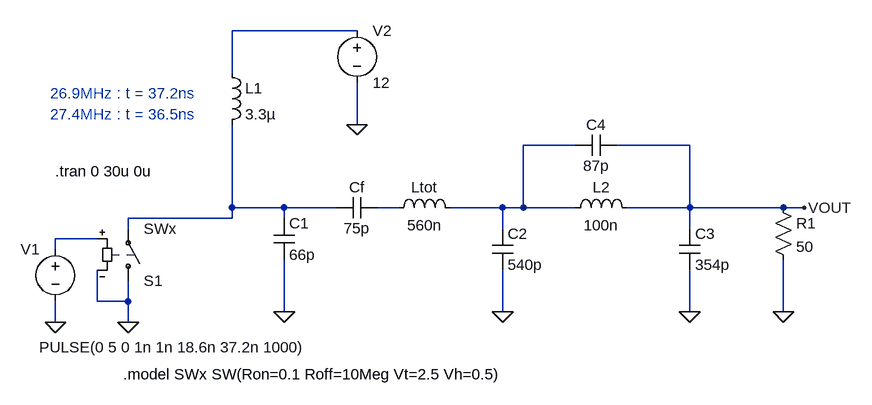
[diagram p0: schematic KD9PDP_PiMatchNotch.asc]
KD9PDP_PiMatchNotch.asc, the LTspice schematic file:
Version 4
SHEET 1 1900 680
WIRE 464 -144 272 -144
WIRE 272 -80 272 -144
WIRE 464 0 464 -64
WIRE 800 32 720 32
WIRE 976 32 864 32
WIRE 272 128 272 0
WIRE 352 128 272 128
WIRE 432 128 352 128
WIRE 528 128 496 128
WIRE 688 128 608 128
WIRE 720 128 720 32
WIRE 720 128 688 128
WIRE 800 128 720 128
WIRE 976 128 976 32
WIRE 976 128 880 128
WIRE 1120 128 976 128
WIRE 1152 128 1120 128
WIRE 272 144 272 128
WIRE 272 144 112 144
WIRE 352 144 352 128
WIRE 112 160 112 144
WIRE 688 160 688 128
WIRE 976 160 976 128
WIRE 64 176 0 176
WIRE 0 192 0 176
WIRE 64 272 64 224
WIRE 112 272 112 240
WIRE 112 272 64 272
WIRE 352 288 352 208
WIRE 688 288 688 224
WIRE 976 288 976 224
WIRE 1120 288 1120 208
WIRE 0 304 0 272
WIRE 112 304 112 272
FLAG 0 304 0
FLAG 464 0 0
FLAG 112 304 0
FLAG 352 288 0
FLAG 688 288 0
FLAG 976 288 0
FLAG 1152 128 VOUT
FLAG 1120 288 0
SYMBOL voltage 0 176 M0
WINDOW 123 0 0 Left 0
WINDOW 39 0 0 Left 0
WINDOW 3 -387 167 Left 2
SYMATTR Value PULSE(0 5 0 1n 1n 18.6n 37.2n 1000)
SYMATTR InstName V1
SYMBOL voltage 464 -160 R0
WINDOW 123 0 0 Left 0
WINDOW 39 0 0 Left 0
SYMATTR InstName V2
SYMATTR Value 12
SYMBOL cap 336 144 R0
SYMATTR InstName C1
SYMATTR Value 66p
SYMBOL ind 256 -96 R0
SYMATTR InstName L1
SYMATTR Value 3.3µ
SYMBOL cap 496 112 R90
WINDOW 0 0 32 VBottom 2
WINDOW 3 32 32 VTop 2
SYMATTR InstName Cf
SYMATTR Value 75p
SYMBOL ind 512 144 R270
WINDOW 0 32 56 VTop 2
WINDOW 3 5 56 VBottom 2
SYMATTR InstName Ltot
SYMATTR Value 560n
SYMBOL cap 672 160 R0
SYMATTR InstName C2
SYMATTR Value 540p
SYMBOL sw 112 256 M180
SYMATTR InstName S1
SYMATTR Value SWx
SYMBOL cap 960 160 R0
SYMATTR InstName C3
SYMATTR Value 354p
SYMBOL cap 864 16 R90
WINDOW 0 0 32 VBottom 2
WINDOW 3 32 32 VTop 2
SYMATTR InstName C4
SYMATTR Value 87p
SYMBOL ind 784 144 R270
WINDOW 0 32 56 VTop 2
WINDOW 3 5 56 VBottom 2
SYMATTR InstName L2
SYMATTR Value 100n
SYMBOL res 1104 112 R0
SYMATTR InstName R1
SYMATTR Value 50
TEXT 0 72 Left 2 !.tran 0 30u 0u
TEXT 104 384 Left 2 !.model SWx SW(Ron=0.1 Roff=10Meg Vt=2.5 Vh=0.5)
TEXT -8 -48 Left 2 ;26.9MHz : t = 37.2ns
TEXT -8 -16 Left 2 ;27.4MHz : t = 36.5ns

The netlist it stands for:
* KD9PDP_PiMatchNotch.asc
V1 N005 0 PULSE(0 5 0 1n 1n 18.6n 37.2n 1000)
V2 N001 0 12
C1 N003 0 66p
L1 N001 N003 3.3µ
Cf N004 N003 75p
Ltot N004 N002 560n
C2 N002 0 540p
S1 0 N003 N005 0 SWx
C3 VOUT 0 354p
C4 VOUT N002 87p
L2 N002 VOUT 100n
R1 VOUT 0 50
.tran 0 30u 0u
.model SWx SW(Ron=0.1 Roff=10Meg Vt=2.5 Vh=0.5)
* 26.9MHz : t = 37.2ns
* 27.4MHz : t = 36.5ns
.backanno
.end